# Altium schematic sheet MCU.SchDoc
size A3; SheetNumber: 3; SheetTotal: 3
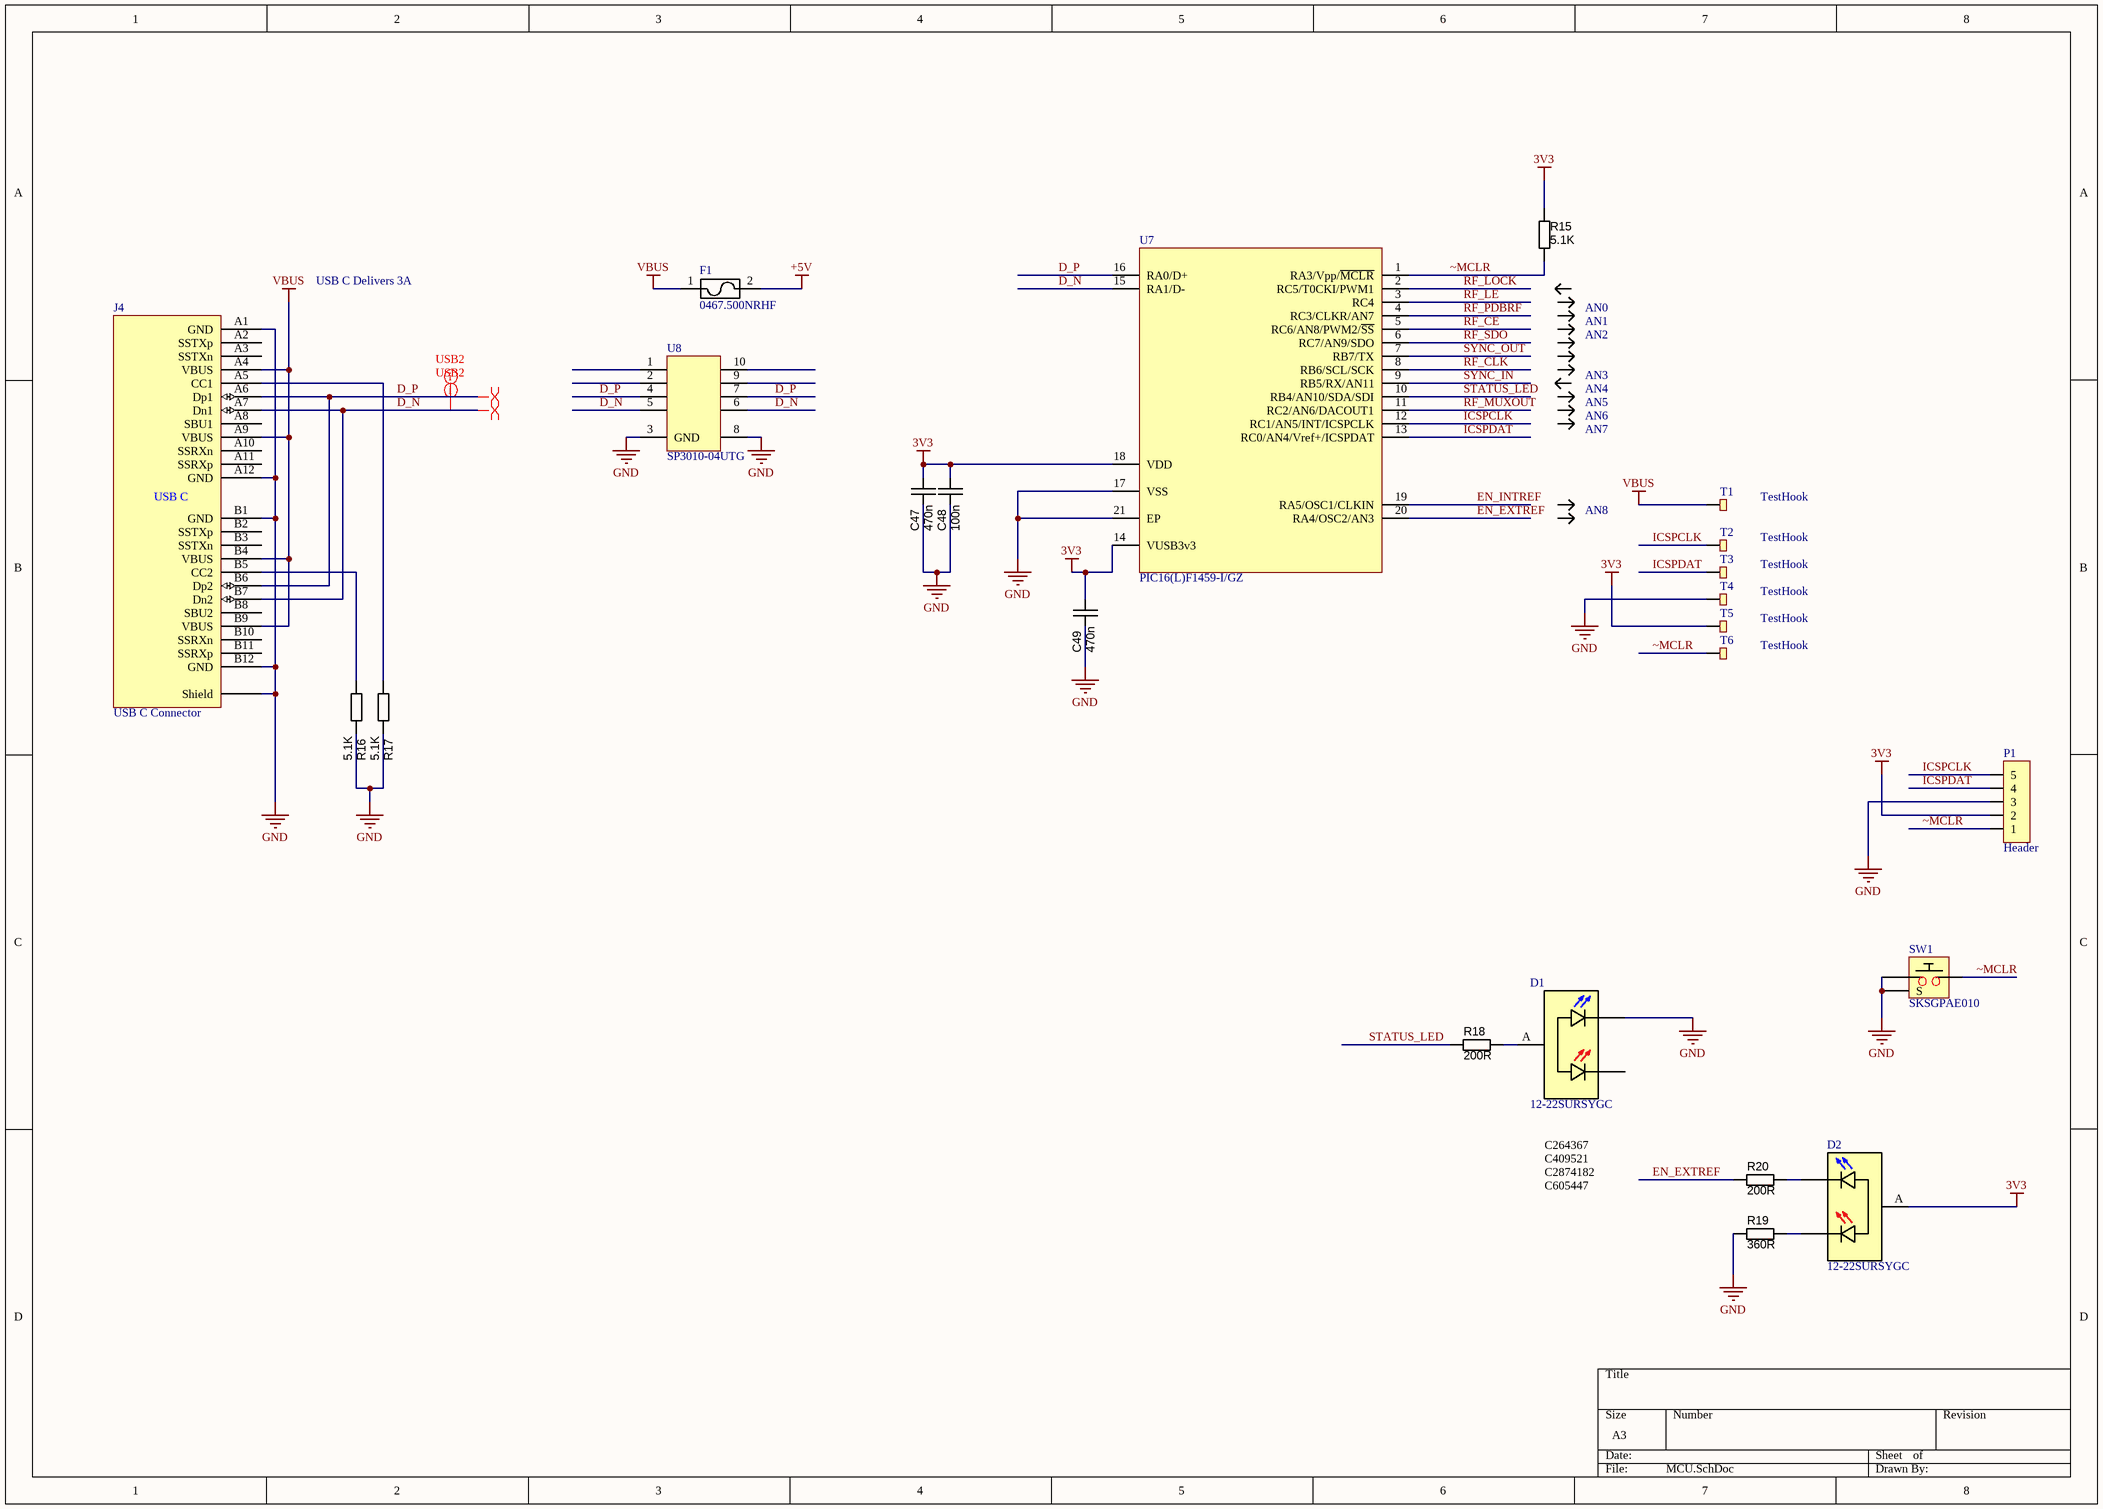
[diagram p0: MCU.SchDoc]

## Parts
C47  470n  [CAPC1005N]
C48  100n  [CAPC1005N]
C49  470n  [CAPC1005N]
D1  12-22SURSYGC  [12-22SURSYGC/S530-A2/TR8]
D2  12-22SURSYGC  [12-22SURSYGC/S530-A2/TR8]
F1  0467.500NRHF  [0467005.NRHF]
J4  USB C Connector  [UT11113-11602-7H]
P1  Header  [HEADER5X]
R15  value 5.1K  [RESC1005N]  (hidden comment: Thick Film)
R16  value 5.1K  [RESC1005N]  (hidden comment: Thick Film)
R17  value 5.1K  [RESC1005N]  (hidden comment: Thick Film)
R18  value 200R  [RESC1005N]  (hidden comment: Thick Film)
R19  value 360R  [RESC1005N]  (hidden comment: Thick Film)
R20  value 200R  [RESC1005N]  (hidden comment: Thick Film)
SW1  SKSGPAE010  [SKSGPAE010]
T1  TestHook  [Test_PAD_0851-0-15-20-82-14-11-0]
T2  TestHook  [Test_PAD_0851-0-15-20-82-14-11-0]
T3  TestHook  [Test_PAD_0851-0-15-20-82-14-11-0]
T4  TestHook  [Test_PAD_0851-0-15-20-82-14-11-0]
T5  TestHook  [Test_PAD_0851-0-15-20-82-14-11-0]
T6  TestHook  [Test_PAD_0851-0-15-20-82-14-11-0]
U7  PIC16(L)F1459-I/GZ  [QFN20_4x4]
U8  SP3010-04UTG  [uDFN-10]

## Nets
3V3: C47.2 C48.2 C49.2 D2.A P1.2 R15.2 T5.1(TP) U7.14(VUSB3v3) U7.18(VDD)
+5V: F1.2
GND: C47.1 C48.1 C49.1 D1.C1(R_C) J4.0(Shield) J4.A1(GND) J4.A12(GND) J4.B1(GND) J4.B12(GND) P1.3 R16.2 R17.2 R19.2 SW1.1(P1) SW1.3(S) T4.1(TP) U7.17(VSS) U7.21(EP) U8.3(GND) U8.8(GND)
VBUS: F1.1 J4.A4(VBUS) J4.A9(VBUS) J4.B4(VBUS) J4.B9(VBUS) T1.1(TP)
D_N: J4.A7(Dn1) J4.B7(Dn2) U7.15(RA1/D-) U8.5 U8.6
D_P: J4.A6(Dp1) J4.B6(Dp2) U7.16(RA0/D+) U8.4 U8.7
EN_EXTREF: R20.2 U7.20(RA4/OSC2/AN3)
EN_INTREF: U7.19(RA5/OSC1/CLKIN)
ICSPCLK: P1.5 T2.1(TP) U7.12(RC1/AN5/INT/ICSPCLK)
ICSPDAT: P1.4 T3.1(TP) U7.13(RC0/AN4/Vref+/ICSPDAT)
RF_CE: U7.5(RC6/AN8/PWM2/~{SS})
RF_CLK: U7.8(RB6/SCL/SCK)
RF_LE: U7.3(RC4)
RF_LOCK: U7.2(RC5/T0CKI/PWM1)
RF_MUXOUT: U7.11(RC2/AN6/DACOUT1)
RF_PDBRF: U7.4(RC3/CLKR/AN7)
RF_SDO: U7.6(RC7/AN9/SDO)
STATUS_LED: R18.1 U7.10(RB4/AN10/SDA/SDI)
SYNC_IN: U7.9(RB5/RX/AN11)
SYNC_OUT: U7.7(RB7/TX)
~MCLR: P1.1 R15.1 SW1.2(P2) T6.1(TP) U7.1(RA3/Vpp/~{MCLR})
NetD1_A: D1.A R18.2
NetD2_C1: D2.C1(R_C) R20.1
NetD2_C2: D2.C2(G_C) R19.1
NetJ4_A5: J4.A5(CC1) R17.1
NetJ4_B5: J4.B5(CC2) R16.1

Not connected (* = marked no-connect by the designer): D1 C2(G_C); J4 A2(SSTXp) A3(SSTXn) A8(SBU1) A10(SSRXn) A11(SSRXp) B2(SSTXp) B3(SSTXn) B8(SBU2) B10(SSRXn) B11(SSRXp); U8 1 2 9 10

## Layout directives
differential pair: D_N, D_P
net class USB2: D_N, D_P

## Notes on the sheet
- USB C Delivers 3A
- AN0
- AN1
- AN2
- AN3
- AN4
- AN5
- AN6
- AN7
- AN8
- C264367
- C409521
- C2874182
- C605447
- (in symbol USB_C) USB C

## Library data of the parts
C47-C49 = CAPC_10n_0402_16V_10%: Capacitor SMD Cer 10nF 10% 16V X7R 0402; Manufacturer 1: AVX Corporation; Manufacturer Part Number 1: 0402YC103KAT2A; Ratings: 16V; X7R; Tolerance: ±10%; Operating Temperature: -55°C ~ 125°C; Package / Case: 0402 (1005 Metric); Size / Dimension: 0.039" L x 0.020" W (1.00mm x 0.50mm); Manufacturer 2: Yageo; Manufacturer Part Number 2: CC0402KRX7R7BB103; Supplier 1: Digi-Key; Supplier Part Number 1: 478-1114-1-ND; ComponentLink1URL: http://www.avx.com/docs/Catalogs/cx7r.pdf; ComponentLink1Description: http://www.avx.com/docs/Catalogs/cx7r.pdf; Supplier 2: Digi-Key; Supplier Part Number 2: 311-1042-1-ND; ComponentLink2URL: http://www.yageo.com/documents/recent/UPY-GPHC_X7R_6.3V-to-50V_8.pdf; ComponentLink2Description: http://www.yageo.com/documents/recent/UPY-GPHC_X7R_6.3V-to-50V_8.pdf
  C47 C49: Value: 470n
  C48: Value: 100n
D1 D2 = BI_LED: 12-22SURSYGC/S530-A3/E2/TR8
F1 = Fuse: 0467005.NRHF
J4 = USB_C
P1 = Header_5Pin: 5 Pin Header
R15-R20 = RES_3K3_0402_5%: Resistor SMD chip 3.3k Ohm 0.063W 5% 0402; Manufacturer 1: Yageo; Manufacturer Part Number 1: RC0402JR-073K3L; Ratings: 1/16 W; Package / Case: 0402 (1005 metric); Tolerance: ±5%; Material: Thick Film; Supplier 1: Digi-Key; Supplier Part Number 1: 311-3.3KJRCT-ND; ComponentLink1URL: http://www.yageo.com/documents/recent/PYu-RC0402_51_RoHS_L_6.pdf; ComponentLink1Description: http://www.yageo.com/documents/recent/PYu-RC0402_51_RoHS_L_6.pdf
SW1 = PushButton_Grounded
U8 = SP3010-04UTG: ESD Protection